# EAGLE schematic 3x3Top (EAGLE 7.3.0)
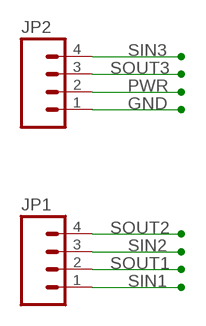
[diagram p0: schematic, sheet 1]

## Parts
JP1  M04PTH  [1X04]
JP2  M04PTH  [1X04]

## Nets
GND: JP2.1
PWR: JP2.2
SIN1: JP1.1
SIN2: JP1.3
SIN3: JP2.4
SOUT1: JP1.2
SOUT2: JP1.4
SOUT3: JP2.3

## Library data of the parts
JP1 JP2 = SparkFun-Connectors:M04: Header 4 Standard 4-pin 0.1" header. Use with straight break away headers (SKU : PRT-00116), right angle break away headers (PRT-00553), swiss pins (PRT-00743), machine pins (PRT-00117), and female headers (PRT-00115). Molex polarized connector foot print use with SKU : PRT-08231 with associated crimp pins and housings. 1MM SMD Version SKU: PRT-10208